# Altium schematic sheet HOST_JTAG.SchDoc: Local MCU Debug Connector
size A4; DocumentNumber: 24; SheetNumber: 25; SheetTotal: 78
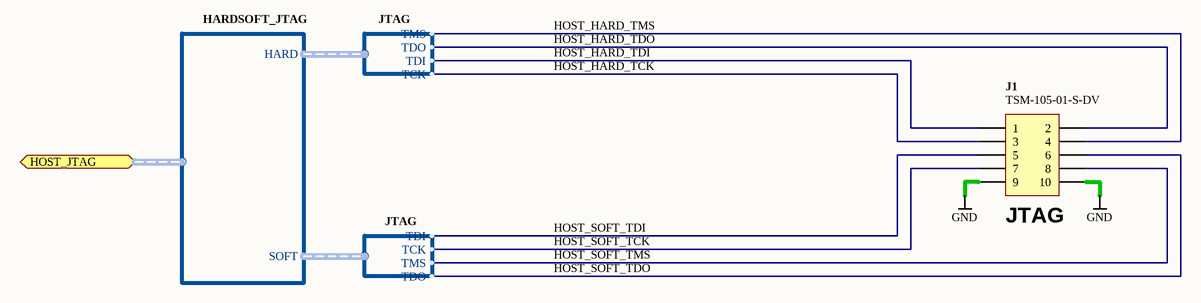
[diagram p0: HOST_JTAG.SchDoc]

## Parts
J1  TSM-105-01-S-DV  [TSM-105-01-DV]

## Ports
HOST_JTAG (harness HARDSOFT_JTAG)

## Harnesses
JTAG: TMS, TDO, TDI, TCK
HARDSOFT_JTAG: HARD, SOFT

## Nets
GND: J1.9 J1.10
HOST_HARD_TCK: J1.3 ; harness JTAG.TCK
HOST_HARD_TDI: J1.1 ; harness JTAG.TDI
HOST_HARD_TDO: J1.2 ; harness JTAG.TDO
HOST_HARD_TMS: J1.4 ; harness JTAG.TMS
HOST_SOFT_TCK: J1.7 ; harness JTAG.TCK
HOST_SOFT_TDI: J1.5 ; harness JTAG.TDI
HOST_SOFT_TDO: J1.6 ; harness JTAG.TDO
HOST_SOFT_TMS: J1.8 ; harness JTAG.TMS

## Notes on the sheet
- (near J1) JTAG
- Sheet Title
- Project Title
- Size:
- Date:
- A4
- Assy:
- Time:
- Revision:
- Sheet
- of
- File:

## Library data of the parts
J1 = D-300-0076: Non-Boxed Header IDC, 2 X 5 Pin SMD; Connector type: Boxed; Max Current: mA; Category: Connector; Mounting Technology: Surface Mount; Status: Unreleased